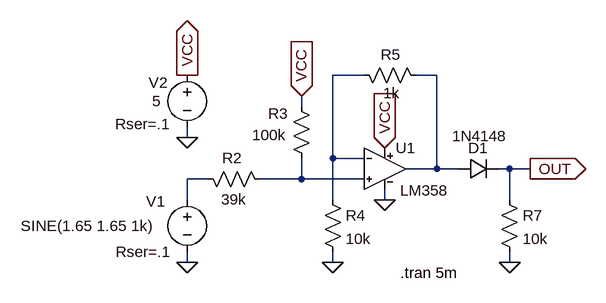
[diagram p0: schematic ESP32_theta.asc]
ESP32_theta.asc, the LTspice schematic file:
Version 4
SHEET 1 1132 680
WIRE 672 -304 624 -304
WIRE 784 -304 752 -304
WIRE 576 -256 576 -272
WIRE 400 -208 400 -224
WIRE 624 -176 624 -304
WIRE 672 -176 624 -176
WIRE 784 -160 784 -304
WIRE 784 -160 736 -160
WIRE 816 -160 784 -160
WIRE 896 -160 880 -160
WIRE 928 -160 896 -160
WIRE 432 -144 400 -144
WIRE 576 -144 576 -176
WIRE 576 -144 512 -144
WIRE 672 -144 576 -144
WIRE 400 -112 400 -144
WIRE 624 -112 624 -176
WIRE 704 -112 704 -128
WIRE 896 -112 896 -160
WIRE 400 -16 400 -32
WIRE 624 -16 624 -32
WIRE 896 -16 896 -32
FLAG 928 -160 OUT
IOPIN 928 -160 Out
FLAG 400 -208 0
FLAG 400 -304 VCC
IOPIN 400 -304 Out
FLAG 400 -16 0
FLAG 704 -112 0
FLAG 704 -192 VCC
IOPIN 704 -192 In
FLAG 576 -272 VCC
IOPIN 576 -272 In
FLAG 624 -16 0
FLAG 896 -16 0
SYMBOL voltage 400 -320 R0
WINDOW 123 0 0 Left 0
WINDOW 39 -111 91 Left 2
WINDOW 0 -59 27 Left 2
WINDOW 3 -54 56 Left 2
SYMATTR SpiceLine Rser=.1
SYMATTR InstName V2
SYMATTR Value 5
SYMBOL voltage 400 -128 R0
WINDOW 0 -63 18 Left 2
WINDOW 3 -256 56 Left 2
WINDOW 123 0 0 Left 0
WINDOW 39 -110 96 Left 2
SYMATTR InstName V1
SYMATTR Value SINE(1.65 1.65 1k)
SYMATTR SpiceLine Rser=.1
SYMBOL res 416 -160 M90
WINDOW 0 -1 53 VBottom 2
WINDOW 3 32 56 VTop 2
SYMATTR InstName R2
SYMATTR Value 39k
SYMBOL res 560 -272 R0
WINDOW 0 -35 27 Left 2
WINDOW 3 -60 60 Left 2
SYMATTR InstName R3
SYMATTR Value 100k
SYMBOL AutoGenerated\\LM358 736 -144 R0
WINDOW 3 29 2 Top 2
SYMATTR InstName U1
SYMBOL res 608 -128 R0
SYMATTR InstName R4
SYMATTR Value 10k
SYMBOL res 656 -320 M90
WINDOW 0 0 57 VBottom 2
WINDOW 3 28 58 VTop 2
SYMATTR InstName R5
SYMATTR Value 1k
SYMBOL diode 816 -144 R270
WINDOW 0 32 32 VTop 2
WINDOW 3 82 34 VBottom 2
SYMATTR InstName D1
SYMATTR Value 1N4148
SYMBOL res 880 -128 R0
SYMATTR InstName R7
SYMATTR Value 10k
TEXT 728 0 Left 2 !.tran 5m

The netlist it stands for:
* ESP32_theta.asc
V2 VCC 0 5 Rser=.1
V1 N003 0 SINE(1.65 1.65 1k) Rser=.1
R2 N003 N004 39k
R3 VCC N004 100k
XU1 N004 N001 VCC 0 N002 LM358  ; pins + - VCC VEE OUT
R4 N001 0 10k
R5 N001 N002 1k
D1 N002 OUT 1N4148
R7 OUT 0 10k
.model D D
.lib standard.dio
.tran 5m
.lib Added\LM358.lib
.backanno
.end